# Altium project Radio_ADC.PrjPcb
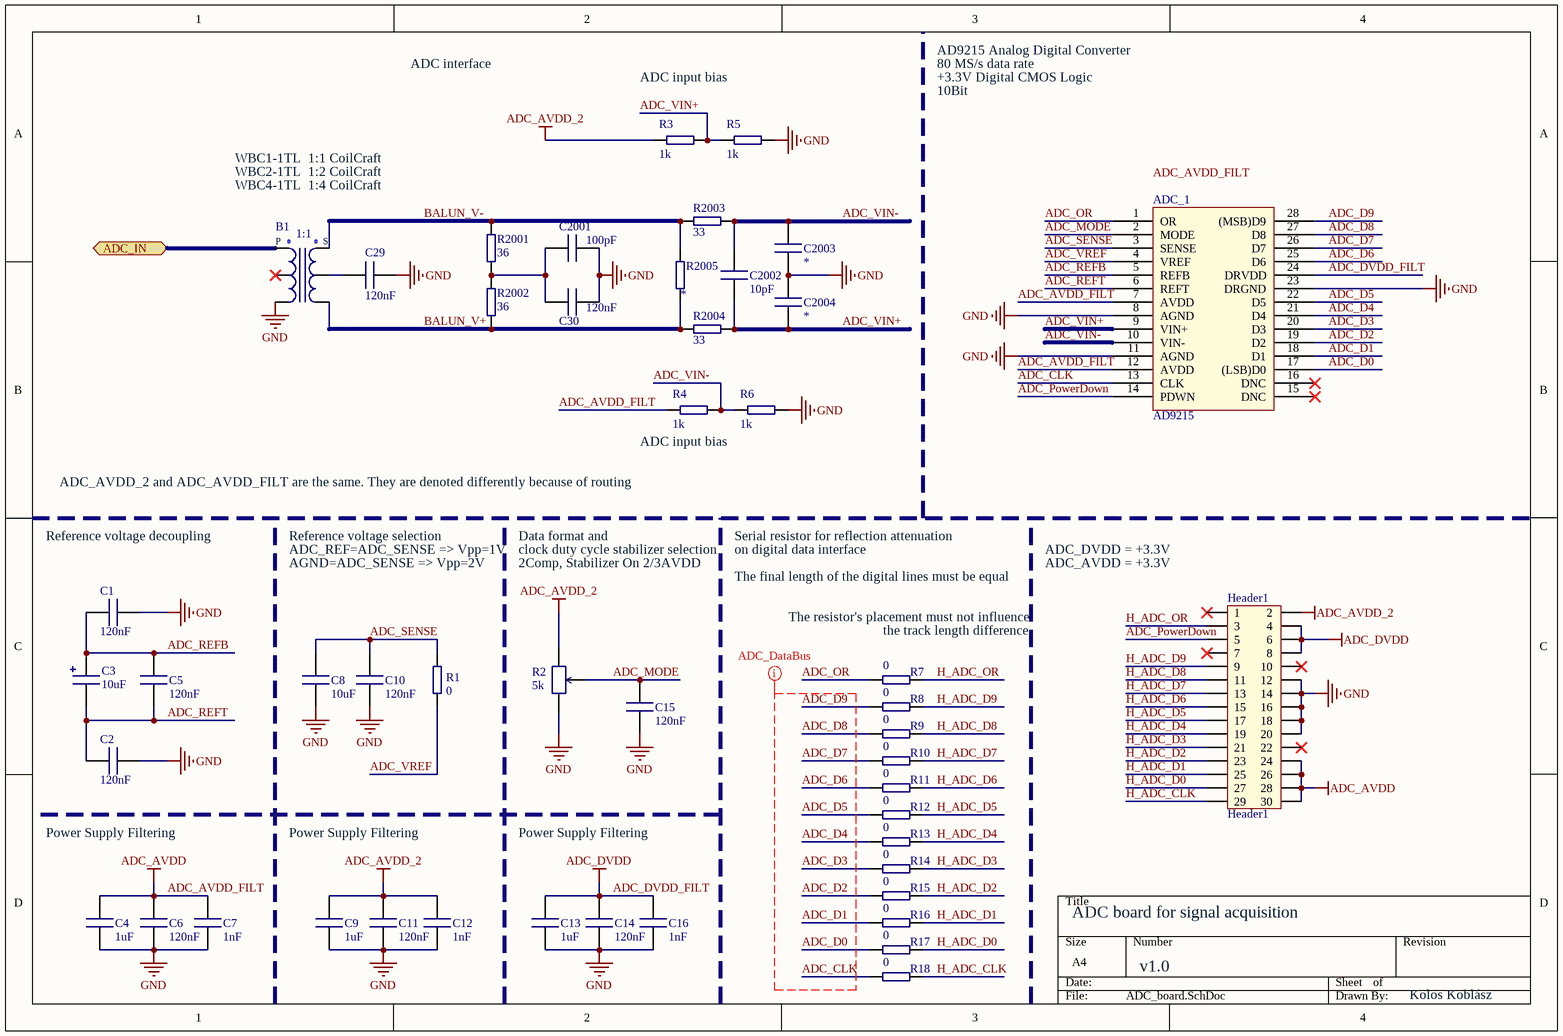
[diagram p0: ADC_board.SchDoc]
2 sheets, 77 parts. Net scope: flat (ports and power ports of the same name join across sheets).
Board file: ADC_Board.PcbDoc
Sheets:
  ADC_board.SchDoc
  ADC_Filter.SchDoc

## Sheet ADC_board.SchDoc
size A4; DocumentNumber: 1; SheetNumber: 1; SheetTotal: 9

### Parts
ADC_1  AD9215  [AD9215]
B1  ImpedanceTransformation P : S: 1:1  [Balun_Coil_Craft_WBC]  (hidden comment: Balun)
C1  value 120nF  [0805 SMD Passive]  (hidden comment: Cap1)
C2  value 120nF  [0805 SMD Passive]  (hidden comment: Cap1)
C3  value 10uF  [ELKO_CAP]  (hidden comment: Cap2)
C4  value 1uF  [0805 SMD Passive]  (hidden comment: Cap1)
C5  value 120nF  [0805 SMD Passive]  (hidden comment: Cap1)
C6  value 120nF  [0805 SMD Passive]  (hidden comment: Cap1)
C7  value 1nF  [0805 SMD Passive]  (hidden comment: Cap1)
C8  value 10uF  [0805 SMD Passive]  (hidden comment: Cap1)
C9  value 1uF  [0805 SMD Passive]  (hidden comment: Cap1)
C10  value 120nF  [0805 SMD Passive]  (hidden comment: Cap1)
C11  value 120nF  [0805 SMD Passive]  (hidden comment: Cap1)
C12  value 1nF  [0805 SMD Passive]  (hidden comment: Cap1)
C13  value 1uF  [0805 SMD Passive]  (hidden comment: Cap1)
C14  value 120nF  [0805 SMD Passive]  (hidden comment: Cap1)
C15  value 120nF  [0805 SMD Passive]  (hidden comment: Cap1)
C16  value 1nF  [0805 SMD Passive]  (hidden comment: Cap1)
C29  value 120nF  [0805 SMD Passive]  (hidden comment: Cap1)
C30  value 120nF  [0805 SMD Passive]  (hidden comment: Cap1)
C2001  value 100pF  [0805 SMD Passive]  (hidden comment: Cap1)
C2002  value 10pF  [0805 SMD Passive]  (hidden comment: Cap1)
C2003  Cap1  [0805 SMD Passive]  (value not drawn)
C2004  Cap1  [0805 SMD Passive]  (value not drawn)
Header1  Header1  [Header1]
R1  value 0  [0805 SMD Passive]  (hidden comment: Resistor)
R2  value 5k  [TC33-2]  (hidden comment: VariableResistor)
R3  value 1k  [0805 SMD Passive]  (hidden comment: Resistor)
R4  value 1k  [0805 SMD Passive]  (hidden comment: Resistor)
R5  value 1k  [0805 SMD Passive]  (hidden comment: Resistor)
R6  value 1k  [0805 SMD Passive]  (hidden comment: Resistor)
R7  value 0  [0805 SMD Passive]  (hidden comment: Resistor)
R8  value 0  [0805 SMD Passive]  (hidden comment: Resistor)
R9  value 0  [0805 SMD Passive]  (hidden comment: Resistor)
R10  value 0  [0805 SMD Passive]  (hidden comment: Resistor)
R11  value 0  [0805 SMD Passive]  (hidden comment: Resistor)
R12  value 0  [0805 SMD Passive]  (hidden comment: Resistor)
R13  value 0  [0805 SMD Passive]  (hidden comment: Resistor)
R14  value 0  [0805 SMD Passive]  (hidden comment: Resistor)
R15  value 0  [0805 SMD Passive]  (hidden comment: Resistor)
R16  value 0  [0805 SMD Passive]  (hidden comment: Resistor)
R17  value 0  [0805 SMD Passive]  (hidden comment: Resistor)
R18  value 0  [0805 SMD Passive]  (hidden comment: Resistor)
R2001  value 36  [0805 SMD Passive]  (hidden comment: Resistor)
R2002  value 36  [0805 SMD Passive]  (hidden comment: Resistor)
R2003  value 33  [0805 SMD Passive]  (hidden comment: Resistor)
R2004  value 33  [0805 SMD Passive]  (hidden comment: Resistor)
R2005  Resistor  [0805 SMD Passive]  (value not drawn)

### Ports
ADC_IN

### Nets
ADC_AVDD_2: C9.1 C11.1 C12.1 Header1.2 R2.1 R3.1
ADC_AVDD_FILT: ADC_1.7(AVDD) ADC_1.12(AVDD) C4.1 C6.1 C7.1 Header1.24 Header1.26 Header1.28 Header1.30 R4.1  [also labelled ADC_AVDD]
ADC_DVDD_FILT: ADC_1.24(DRVDD) C13.1 C14.1 C16.1 Header1.4 Header1.6 Header1.8  [also labelled ADC_DVDD]
GND: ADC_1.8(AGND) ADC_1.11(AGND) ADC_1.23(DRGND) B1.4 C1.1 C2.2 C4.2 C6.2 C7.2 C8.2 C9.2 C10.2 C11.2 C12.2 C13.2 C14.2 C15.2 C16.2 C29.1 C30.1 C2001.1 C2003.2 C2004.1 Header1.12 Header1.14 Header1.16 Header1.18 Header1.20 R2.2 R5.2 R6.2
ADC_CLK: ADC_1.13(CLK) R18.1
ADC_D0: ADC_1.17((LSB)D0) R17.1
ADC_D1: ADC_1.18(D1) R16.1
ADC_D2: ADC_1.19(D2) R15.1
ADC_D3: ADC_1.20(D3) R14.1
ADC_D4: ADC_1.21(D4) R13.1
ADC_D5: ADC_1.22(D5) R12.1
ADC_D6: ADC_1.25(D6) R11.1
ADC_D7: ADC_1.26(D7) R10.1
ADC_D8: ADC_1.27(D8) R9.1
ADC_D9: ADC_1.28((MSB)D9) R8.1
ADC_MODE: ADC_1.2(MODE) C15.1 R2.3
ADC_OR: ADC_1.1(OR) R7.1
ADC_PowerDown: ADC_1.14(PDWN) Header1.5
ADC_REFB: ADC_1.5(REFB) C1.2 C3.1 C5.1
ADC_REFT: ADC_1.6(REFT) C2.1 C3.2 C5.2
ADC_SENSE: ADC_1.3(SENSE) C8.1 C10.1 R1.2
ADC_VIN+: ADC_1.9(VIN+) C2002.2 C2004.2 R3.2 R5.1 R2004.2
ADC_VIN-: ADC_1.10(VIN-) C2002.1 C2003.1 R4.2 R6.1 R2003.2
ADC_VREF: ADC_1.4(VREF) R1.1
BALUN_V+: B1.3 R2002.1 R2004.1 R2005.1
BALUN_V-: B1.1 R2001.2 R2003.1 R2005.2
Filter_Output: B1.6 ; port ADC_IN
H_ADC_CLK: Header1.29 R18.2
H_ADC_D0: Header1.27 R17.2
H_ADC_D1: Header1.25 R16.2
H_ADC_D2: Header1.23 R15.2
H_ADC_D3: Header1.21 R14.2
H_ADC_D4: Header1.19 R13.2
H_ADC_D5: Header1.17 R12.2
H_ADC_D6: Header1.15 R11.2
H_ADC_D7: Header1.13 R10.2
H_ADC_D8: Header1.11 R9.2
H_ADC_D9: Header1.9 R8.2
H_ADC_OR: Header1.3 R7.2
NetB1_2: B1.2 C29.2
NetC30_2: C30.2 C2001.2 R2001.1 R2002.2

Not connected (* = marked no-connect by the designer): ADC_1 15(DNC)* 16(DNC)*; B1 5*; Header1 1* 7* 10* 22*

### Layout directives
net class ADC_DataBus: ADC_CLK, ADC_D0, ADC_D1, ADC_D2, ADC_D3, ADC_D4, ADC_D5, ADC_D6, ADC_D7, ADC_D8, ADC_D9

### Notes on the sheet
- ADC interface
- ADC input bias
- AD9215 Analog Digital Converter
- 80 MS/s data rate
- +3.3V Digital CMOS Logic
- 10Bit
- WBC1-1TL  1:1 CoilCraft
- WBC2-1TL  1:2 CoilCraft
- WBC4-1TL  1:4 CoilCraft
- ADC_AVDD_2 and ADC_AVDD_FILT are the same. They are denoted differently because of routing
- Reference voltage decoupling
- Reference voltage selection
- ADC_REF=ADC_SENSE => Vpp=1V
- AGND=ADC_SENSE => Vpp=2V
- Data format and
- clock duty cycle stabilizer selection
- 2Comp, Stabilizer On 2/3AVDD
- Serial resistor for reflection attenuation
- on digital data interface
- The final length of the digital lines must be equal
- ADC_DVDD = +3.3V
- ADC_AVDD = +3.3V
- The resistor's placement must not influence
- (near R7) the track length difference
- Power Supply Filtering
- ADC board for signal acquisition
- v1.0
- Kolos Koblász
- Labels drawn without touching a wire or pin: ADC_AVDD_FILT
- (in symbol Balun3) P; S

### Library data of the parts
ADC_1 = AD9215: Analog Digital Converter; Manufacturer: Analog Devices; OrderCode: AD9215BRUZ-80; PartNumber: AD9215; FootPrint: RU-28
B1 = Balun3: SMD Balun; Manufacturer: CoilCraft; PartNumber: WBC1-1TL; MaxFrequency: 700MHz; MinFrequency: 0.25MHz; FootPrint: SMD
C1 C2 C4-C16 C29 C30 C2001-C2004 = Cap1: SMD Capacitor; Precision: 1%; MaxVolt: 16V; FootPrint: *
  C2003 C2004: Value: *
C3 = Cap2: SMD Polarized Capacitor; Precision: 1%; MaxVolt: 16V; FootPrint: *
Header1 = Header1: 29 Pin Header; PartNumber: TLW-115-01-G-D-002-RA; Manufacterer: Samtec; PinNumber: 29; Row: 2; Pitch: 2.54mm; Type: 90°
R1 R3-R18 R2001-R2005 = Res1: SMD Resistor; Precision: 1%; MaxPower: 0.1W; FootPrint: SMD
  R2005: Value: *
R2 = VarRes1: SMD Variable Resistor; Precision: 1%; MaxPower: 0.1W; FootPrint: SMD; Manufacturer ID: *

## Sheet ADC_Filter.SchDoc
size A4; DocumentNumber: 4; SheetNumber: 4; SheetTotal: 9
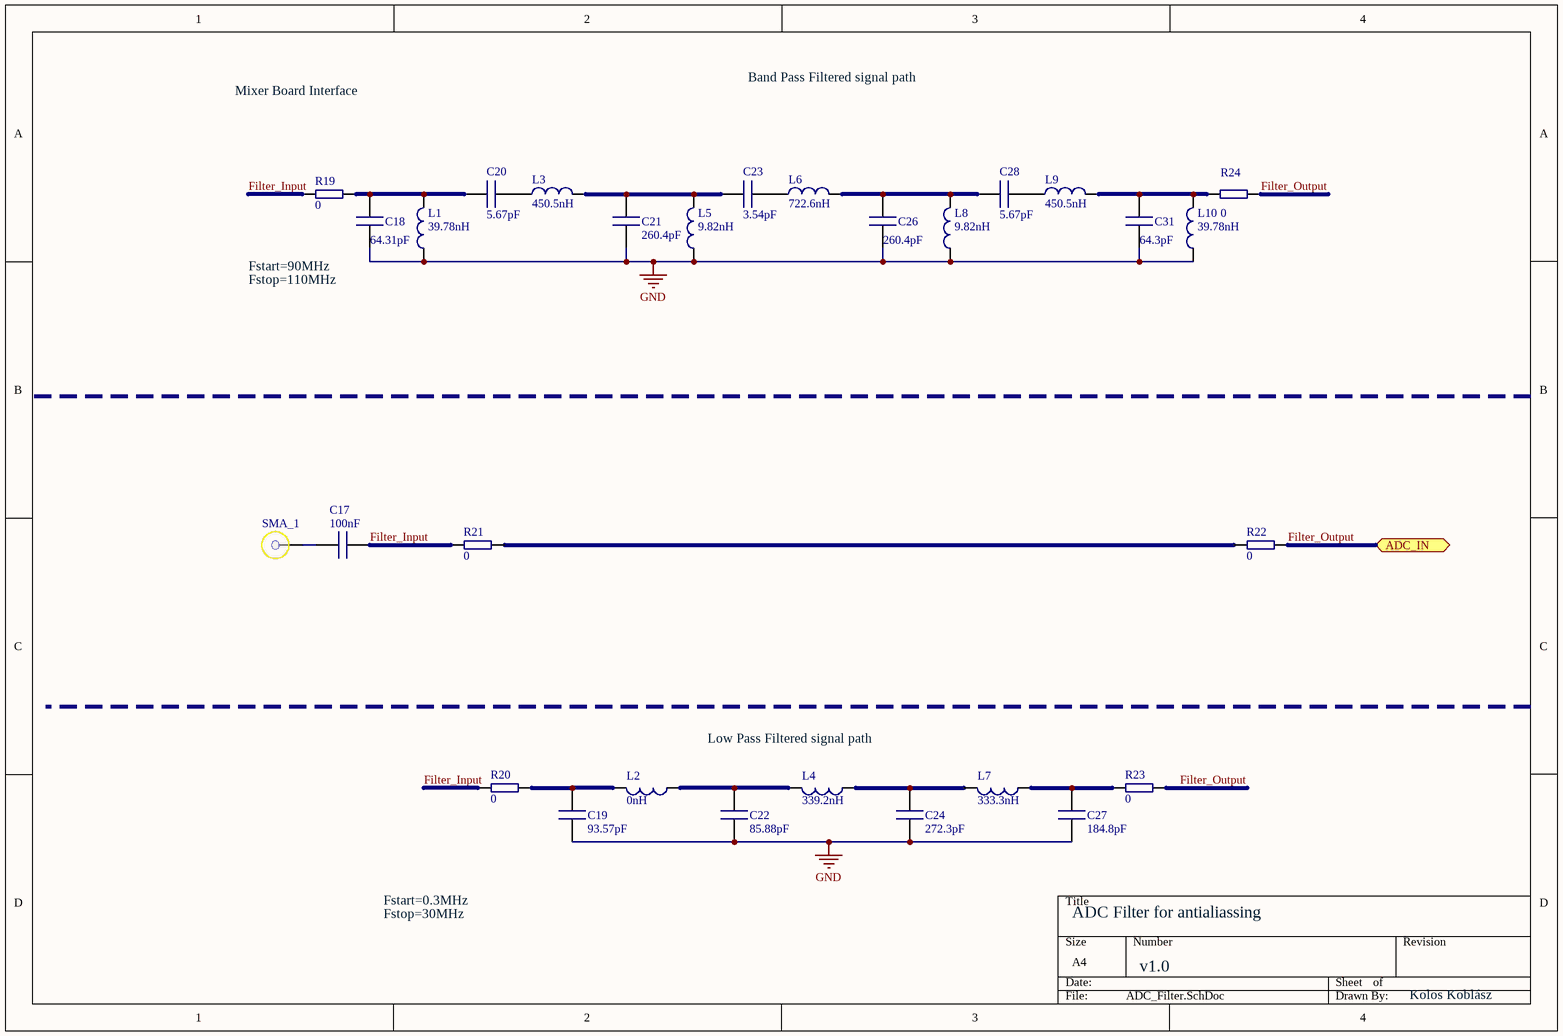
[diagram p1: ADC_Filter.SchDoc]

### Parts
C17  value 100nF  [0805 SMD Passive]  (hidden comment: Cap1)
C18  value 64.31pF  [0805 SMD Passive]  (hidden comment: Cap1)
C19  value 93.57pF  [0805 SMD Passive]  (hidden comment: Cap1)
C20  value 5.67pF  [0805 SMD Passive]  (hidden comment: Cap1)
C21  value 260.4pF  [0805 SMD Passive]  (hidden comment: Cap1)
C22  value 85.88pF  [0805 SMD Passive]  (hidden comment: Cap1)
C23  value 3.54pF  [0805 SMD Passive]  (hidden comment: Cap1)
C24  value 272.3pF  [0805 SMD Passive]  (hidden comment: Cap1)
C26  value 260.4pF  [0805 SMD Passive]  (hidden comment: Cap1)
C27  value 184.8pF  [0805 SMD Passive]  (hidden comment: Cap1)
C28  value 5.67pF  [0805 SMD Passive]  (hidden comment: Cap1)
C31  value 64.3pF  [0805 SMD Passive]  (hidden comment: Cap1)
L1  value 39.78nH  [0805 SMD Passive]  (hidden comment: Inductor)
L2  value 0nH  [0805 SMD Passive]  (hidden comment: Inductor)
L3  value 450.5nH  [0805 SMD Passive]  (hidden comment: Inductor)
L4  value 339.2nH  [0805 SMD Passive]  (hidden comment: Inductor)
L5  value 9.82nH  [0805 SMD Passive]  (hidden comment: Inductor)
L6  value 722.6nH  [0805 SMD Passive]  (hidden comment: Inductor)
L7  value 333.3nH  [0805 SMD Passive]  (hidden comment: Inductor)
L8  value 9.82nH  [0805 SMD Passive]  (hidden comment: Inductor)
L9  value 450.5nH  [0805 SMD Passive]  (hidden comment: Inductor)
L10  value 39.78nH  [0805 SMD Passive]  (hidden comment: Inductor)
R19  value 0  [0805 SMD Passive]  (hidden comment: Resistor)
R20  value 0  [0805 SMD Passive]  (hidden comment: Resistor)
R21  value 0  [0805 SMD Passive]  (hidden comment: Resistor)
R22  value 0  [0805 SMD Passive]  (hidden comment: Resistor)
R23  value 0  [0805 SMD Passive]  (hidden comment: Resistor)
R24  value 0  [0805 SMD Passive]  (hidden comment: Resistor)
SMA_1  SMA1  [SMA Flange]  (value not drawn)

### Ports
ADC_IN

### Nets
GND: C18.2 C19.1 C21.2 C22.1 C24.1 C26.2 C27.1 C31.2 L1.1 L5.1 L8.1 L10.1
Filter_Input: C17.1 R19.2 R20.2 R21.2
Filter_Output: R22.1 R23.1 R24.1 ; port ADC_IN
NetC17_2: C17.2 SMA_1.1
NetC18_1: C18.1 C20.1 L1.2 R19.1
NetC19_2: C19.2 L2.2 R20.1
NetC20_2: C20.2 L3.1
NetC21_1: C21.1 C23.1 L3.2 L5.2
NetC22_2: C22.2 L2.1 L4.2
NetC23_2: C23.2 L6.1
NetC24_2: C24.2 L4.1 L7.2
NetC26_1: C26.1 C28.1 L6.2 L8.2
NetC27_2: C27.2 L7.1 R23.2
NetC28_2: C28.2 L9.1
NetC31_1: C31.1 L9.2 L10.2 R24.2
NetR21_1: R21.1 R22.2

### Notes on the sheet
- Mixer Board Interface
- Band Pass Filtered signal path
- Fstart=90MHz
- Fstop=110MHz
- Low Pass Filtered signal path
- Fstart=0.3MHz
- Fstop=30MHz
- ADC Filter for antialiassing
- v1.0
- Kolos Koblász

### Library data of the parts
C17-C24 C26-C28 C31 = Cap1: as C1 on sheet ADC_board; FootPrint: *
L1-L10 = Ind1: SMD Inductor; Precision: 10%; MaxCurent: 100mA; FootPrint: SMD
R19-R24 = Res1: as R1 on sheet ADC_board; FootPrint: SMD
SMA_1 = SMA1: SMA Female; Shape: Straight; Footprint: *; PartNumber: *; Manufacturer: *; OrderCode: *; Mounting: TroughHole

## Nets that join several sheets
GND: ADC_board (31 pins), ADC_Filter (12 pins)
Filter_Output: ADC_board (B1.6), ADC_Filter (R22.1 R23.1 R24.1)